# Altium schematic sheet Powering.SchDoc
size B; SheetNumber: 5; SheetTotal: 6
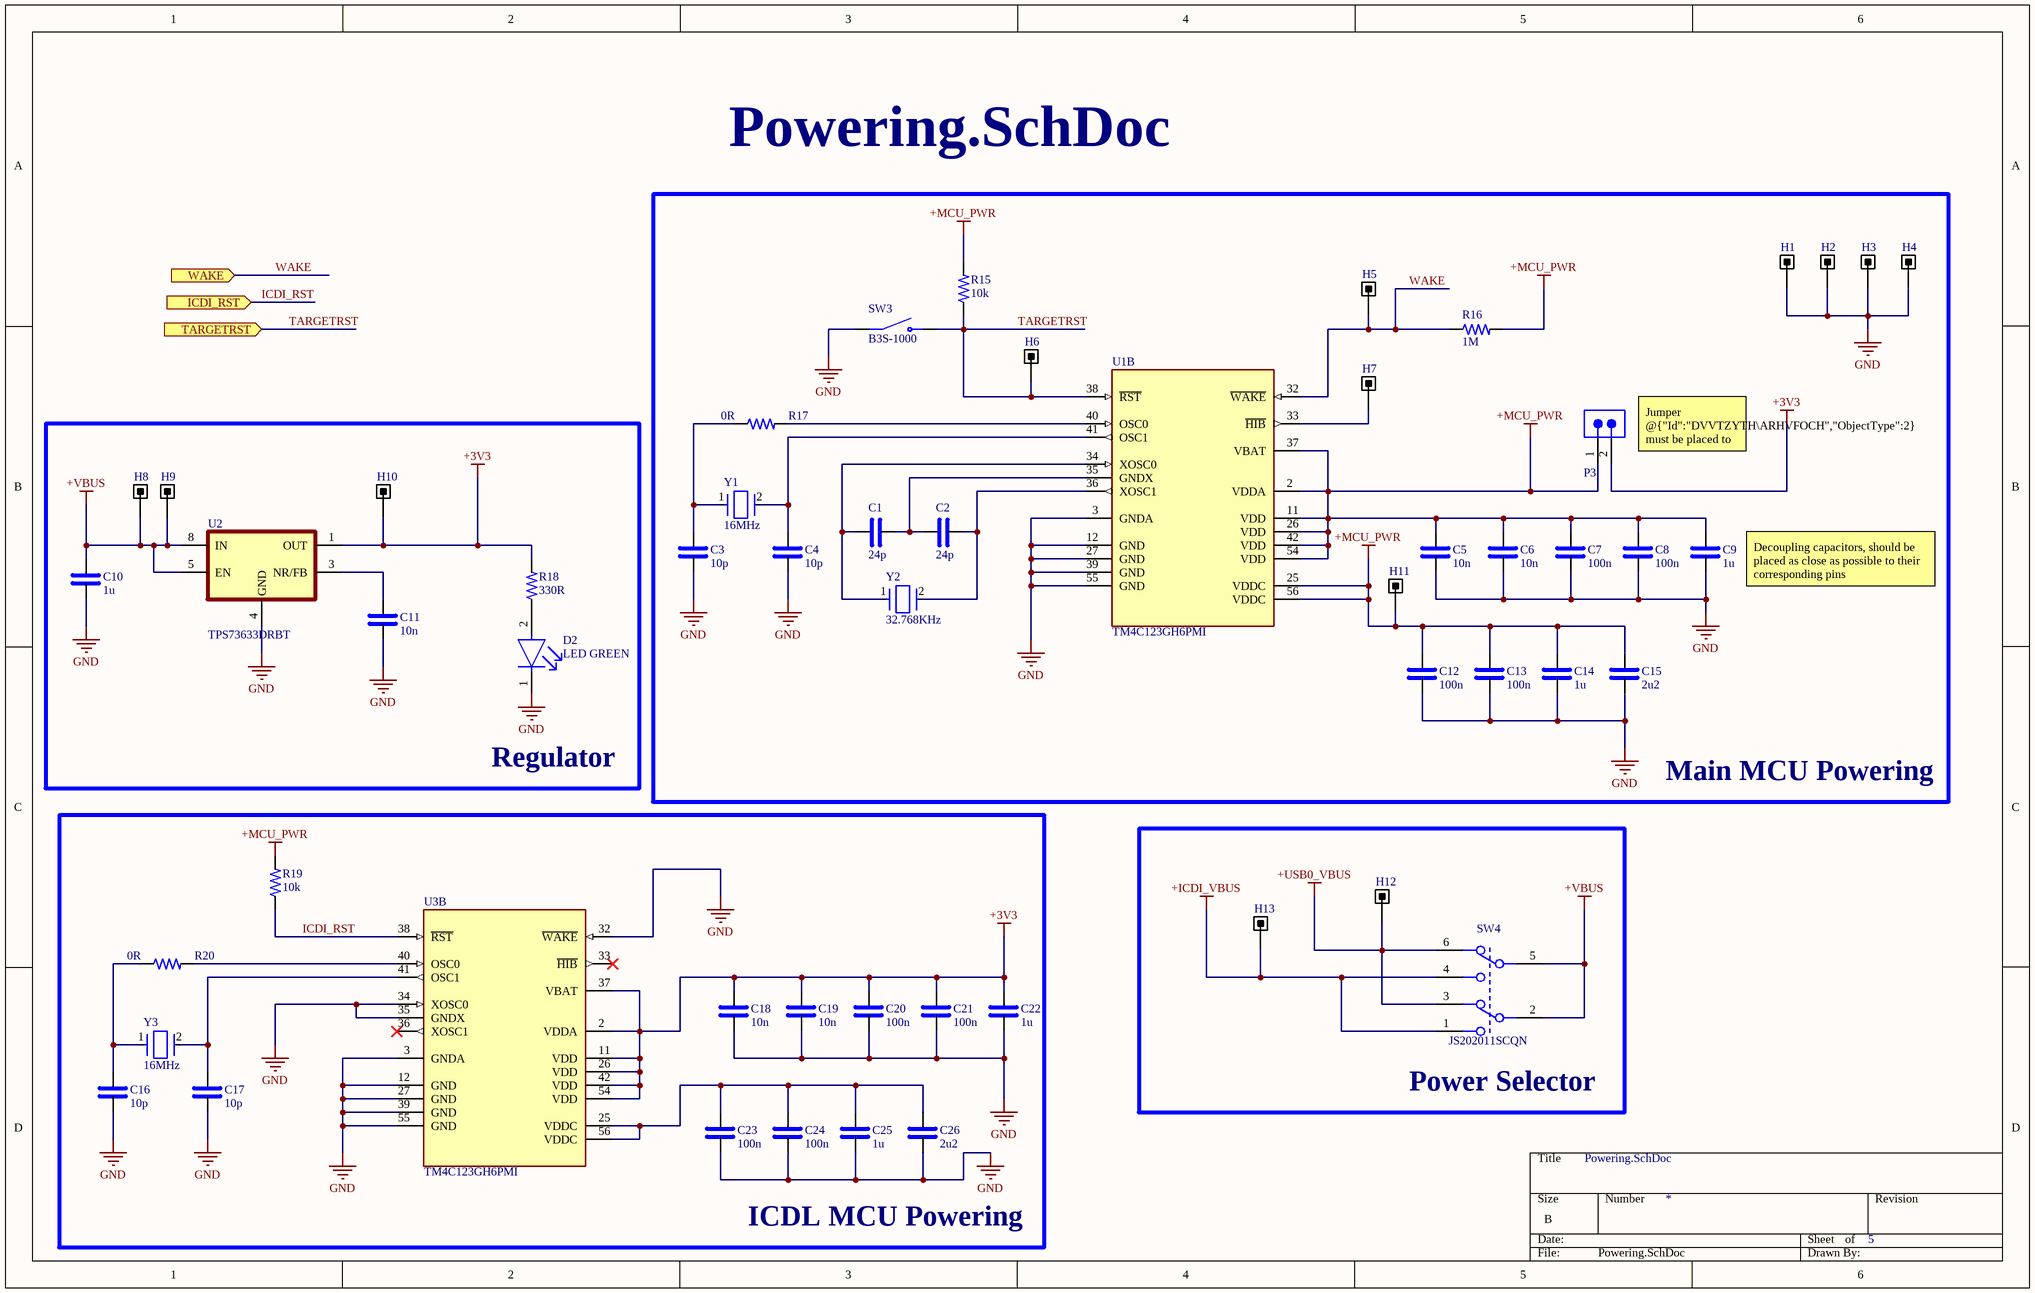
[diagram p0: Powering.SchDoc]

## Parts
C1  24p  [0402 CAP]
C2  24p  [0402 CAP]
C3  10p  [0402 CAP]
C4  10p  [0402 CAP]
C5  10n  [0402 CAP]
C6  10n  [0402 CAP]
C7  100n  [0402 CAP]
C8  100n  [0402 CAP]
C9  1u  [0402 CAP]
C10  1u  [0402 CAP]
C11  10n  [0402 CAP]
C12  100n  [0402 CAP]
C13  100n  [0402 CAP]
C14  1u  [0402 CAP]
C15  2u2  [FP-GCJ188-0_2-IPC_C]
C16  10p  [0402 CAP]
C17  10p  [0402 CAP]
C18  10n  [0402 CAP]
C19  10n  [0402 CAP]
C20  100n  [0402 CAP]
C21  100n  [0402 CAP]
C22  1u  [0402 CAP]
C23  100n  [0402 CAP]
C24  100n  [0402 CAP]
C25  1u  [0402 CAP]
C26  2u2  [FP-GCJ188-0_2-IPC_C]
D2  LED GREEN  [FP-LTST-C171GKT-MFG]
H1  Test Point  [Test Point]  (value not drawn)
H2  Test Point  [Test Point]  (value not drawn)
H3  Test Point  [Test Point]  (value not drawn)
H4  Test Point  [Test Point]  (value not drawn)
H5  Test Point  [Test Point]  (value not drawn)
H6  Test Point  [Test Point]  (value not drawn)
H7  Test Point  [Test Point]  (value not drawn)
H8  Test Point  [Test Point]  (value not drawn)
H9  Test Point  [Test Point]  (value not drawn)
H10  Test Point  [Test Point]  (value not drawn)
H11  Test Point  [Test Point]  (value not drawn)
H12  Test Point  [Test Point]  (value not drawn)
H13  Test Point  [Test Point]  (value not drawn)
P3  61300211121  [61300211121]  (value not drawn)
R15  10k  [0402 RES]
R16  1M  [0402 RES]
R17  0R  [FP-ERA3A-IPC_B]
R18  330R  [0402 RES]
R19  10k  [0402 RES]
R20  0R  [FP-ERA3A-IPC_B]
SW3  B3S-1000  [SW_B3S-1000]
SW4  JS202011SCQN  [FP-JS202011SCQN-MFG]
U1  TM4C123GH6PMI  [QFP50P1200X1200X160-64N]  (part B of 2)
U2  TPS73633DRBT  [IC_DRV8601DRBT]
U3  TM4C123GH6PMI  [QFP50P1200X1200X160-64N]  (part B of 2)
Y1  16MHz  [FP-ABM3-MFG]
Y2  32.768KHz  [FP-AB26TRB-MFG]
Y3  16MHz  [FP-ABM3-MFG]

## Blocks framed on the sheet
Main MCU Powering: C1-C9 C12-C15 H1-H7 H11 P3 R15-R17 SW3 U1 Y1 Y2
Regulator: C10 C11 D2 H8-H10 R18 U2
ICDL MCU Powering: C16-C26 R19 R20 U3 Y3
Power Selector: H12 H13 SW4

## Ports
ICDI_RST (in, see Master[4B], Connectors[6A]), TARGETRST (in, see Master[4B], Connectors[6B], In-Circuit_Debug_Interface[1A]), WAKE (in, see Master[4B], LEDS_SWITCHS[4B])

## Nets
+3V3: C18.2 C19.2 C20.2 C21.2 C22.2 H10.1 P3.2 R18.2 U2.1(OUT) U3.2(VDDA) U3.11(VDD) U3.26(VDD) U3.37(VBAT) U3.42(VDD) U3.54(VDD)
+ICDI_VBUS: H13.1 SW4.1 SW4.4
+MCU_PWR: C5.2 C6.2 C7.2 C8.2 C9.2 C12.2 C13.2 C14.2 C15.2 H11.1 P3.1 R15.2 R16.2 R19.2 U1.2(VDDA) U1.11(VDD) U1.25(VDDC) U1.26(VDD) U1.37(VBAT) U1.42(VDD) U1.54(VDD) U1.56(VDDC)
+USB0_VBUS: H12.1 SW4.3 SW4.6
+VBUS: C10.2 H8.1 H9.1 SW4.2 SW4.5 U2.5(EN) U2.8(IN)
GND: C3.1 C4.1 C5.1 C6.1 C7.1 C8.1 C9.1 C10.1 C11.1 C12.1 C13.1 C14.1 C15.1 C16.1 C17.1 C18.1 C19.1 C20.1 C21.1 C22.1 C23.1 C24.1 C25.1 C26.1 D2.1(C) H1.1 H2.1 H3.1 H4.1 SW3.2(COM) U1.3(GNDA) U1.12(GND) U1.27(GND) U1.39(GND) U1.55(GND) U2.4(GND) U3.3(GNDA) U3.12(GND) U3.27(GND) U3.32(~{WAKE}) U3.34(XOSC0) U3.35(GNDX) U3.39(GND) U3.55(GND)
ICDI_RST: R19.1 U3.38(~{RST}) ; port ICDI_RST
TARGETRST: H6.1 R15.1 SW3.4(NO) U1.38(~{RST}) ; port TARGETRST
WAKE: H5.1 R16.1 U1.32(~{WAKE}) ; port WAKE
NetC1_1: C1.1 C2.2 U1.35(GNDX)
NetC1_2: C1.2 U1.34(XOSC0) Y2.1
NetC2_1: C2.1 U1.36(XOSC1) Y2.2
NetC3_2: C3.2 R17.1 Y1.1
NetC4_2: C4.2 U1.41(OSC1) Y1.2
NetC11_2: C11.2 U2.3(NR/FB)
NetC16_2: C16.2 R20.1 Y3.1
NetC17_2: C17.2 U3.41(OSC1) Y3.2
NetC23_2: C23.2 C24.2 C25.2 C26.2 U3.25(VDDC) U3.56(VDDC)
NetD2_2: D2.2(A) R18.1
NetH7_1: H7.1 U1.33(~{HIB})
NetR17_2: R17.2 U1.40(OSC0)
NetR20_2: R20.2 U3.40(OSC0)

Not connected (* = marked no-connect by the designer): U3 33(~{HIB})* 36(XOSC1)*

## Notes on the sheet
- (near P3) Jumper @{"Id":"DVVTZYTH\ARHVFOCH","ObjectType":2} must be placed to power the MCU.
- (near C9) Decoupling capacitors, should be placed as close as possible to their corresponding pins

## Library data of the parts
C1 C2 = 0402 SMD Capacitor: 24 pF ±5% 50V Ceramic Capacitor C0G, NP0 0402 (1005 Metric); Part Number: C1005C0G1H240J; Capacitance: 10pF; Voltage: 50V; ComponentLink1Description: Link; ComponentLink1URL: *
C3 C4 C16 C17 = 0402 SMD Capacitor: 10 pF ±5% 50V Ceramic Capacitor C0G, NP0 0402 (1005 Metric); Part Number: GRM1555C1H100JZ01D; Capacitance: 10pF; Voltage: 50V; ComponentLink1Description: Link; ComponentLink1URL: *
C5 C6 C11 C18 C19 = 0402 SMD Capacitor: Ceramic Capacitor, Multilayer, Ceramic, 25V, 10% +Tol, 10% -Tol, X7R, 15% TC, 0.01uF, Surface Mount, 0402; Manufacturer: Taiyo Yuden; Manufacturer Part Number: TMK105B7103KV-F; Value: 10nF; Multilayer: Yes; ComponentLink1Description: Link; ComponentLink1URL: *; Supplier Part Number: TMK105B7103KV-F; RoHS: Yes; Category: Ceramic Capacitors; Stock: 90000; Pricing: 10000=0.00213 (USD); Mounting Technology: Surface Mount; Pins: 2; Dielectric Material: Ceramic; Package Shape: Rectangular; Case/Package: 0402; Terminal Finish: Tin; Min Operating Temperature: -55°C; Max Operating Temperature: 125°C; JESD-609 Code: e3; Capacitor Type: Ceramic; Tolerance  (fill in as +-): 10%; Package Style: SMTMeter; Packaging: Tape and Reel; Tolerance (fill in as +-): 10%; Rated DC Voltage (URdc): 25V; Temperature Characteristics Code: X7R; Termination: Wraparound; Length: 1mm; Width: 0.5mm; Height: 0.5mm; Reach SVHC Compliant: Yes; RoHS Compliant: Yes; ComponentLink2URL: https://datasheet.ciiva.com:443/pdfs/VipMasterIC/IC/TAIY/TAIY-S-A0007936089/TAIY-S-A0007936093-1.pdf?src-supplier=IHS+Markit; ComponentLink2Description: https://datasheet.ciiva.com:443/pdfs/VipMasterIC/IC/TAIY/TAIY-S-A0007936089/TAIY-S-A0007936093-1.pdf?src-supplier=IHS+Markit; ComponentLink3URL: https://datasheet.ciiva.com/129/tmk105b7103kv-f-ss-129699.pdf?src-supplier=Digikey; ComponentLink3Description: https://datasheet.ciiva.com/129/tmk105b7103kv-f-ss-129699.pdf?src-supplier=Digikey; ComponentLink4URL: https://datasheet.ciiva.com/15922/204tmk105b7103kv-f-15922348.pdf?src-supplier=Onlinecomponents.com; ComponentLink4Description: https://datasheet.ciiva.com/15922/204tmk105b7103kv-f-15922348.pdf?src-supplier=Onlinecomponents.com; ComponentLink5URL: https://datasheet.ciiva.com/30156/190tmk105b7103kv-f-30156174.pdf?src-supplier=Onlinecomponents.com; ComponentLink5Description: https://datasheet.ciiva.com/30156/190tmk105b7103kv-f-30156174.pdf?src-supplier=Onlinecomponents.com; ComponentLink6URL: https://datasheet.ciiva.com/7975/746258-7975835.pdf?src-supplier=Element14; ComponentLink6Description: https://datasheet.ciiva.com/7975/746258-7975835.pdf?src-supplier=Element14
C7 C8 C12 C13 C20 C21 C23 C24 = 0402 SMD Capacitor: Ceramic Capacitor, Multilayer, Ceramic, 16V, 10% +Tol, 10% -Tol, X7R, 15% TC, 0.1uF, Surface Mount, 0402; Manufacturer: Taiyo Yuden; Manufacturer Part Number: EMK105B7104KV-F; Value: 100nF; Multilayer: Yes; ComponentLink1Description: Link; ComponentLink1URL: *; Supplier: Avnet; Supplier Part Number: EMK105B7104KV-F; RoHS: Yes; Category: Ceramic Capacitors; Stock: 830000; Pricing: 10000=0.00238 (USD); Mounting Technology: Surface Mount; Pins: 2; Dielectric Material: Ceramic; Package Shape: Rectangular; Case/Package: 0402; Terminal Finish: Nickel; Min Operating Temperature: -55°C; Max Operating Temperature: 125°C; JESD-609 Code: e3; Capacitor Type: Ceramic; Tolerance  (fill in as +-): 10%; Package Style: SMTMeter; Packaging: Tape and Reel; Tolerance (fill in as +-): 10%; Rated DC Voltage (URdc): 16V; Temperature Characteristics Code: X7R; Termination: Wraparound; Length: 1mm; Width: 0.5mm; Height: 0.5mm; Reach SVHC Compliant: Yes; RoHS Compliant: Yes; ComponentLink2URL: https://datasheet.ciiva.com:443/pdfs/VipMasterIC/IC/TAIY/TAIY-S-A0009096450/TAIY-S-A0009096704-1.pdf?src-supplier=IHS+Markit; ComponentLink2Description: https://datasheet.ciiva.com:443/pdfs/VipMasterIC/IC/TAIY/TAIY-S-A0009096450/TAIY-S-A0009096704-1.pdf?src-supplier=IHS+Markit
C9 C10 C14 C22 C25 = 0402 SMD Capacitor: Ceramic Capacitor, Ceramic, 10V, 10% +Tol, 10% -Tol, X5R, 15% TC, 1uF, Surface Mount, 0402; Manufacturer: Johanson; Manufacturer Part Number: 100R07X105KV4T; Multilayer: Yes; ComponentLink1Description: Link; ComponentLink1URL: *; Supplier: Mouser; Supplier Part Number: 605-100R07X105KV4T; RoHS: Yes; Category: Ceramic Capacitors; Stock: 57414; Pricing: 1=0.26, 10=0.169, 50=0.169, 100=0.086, 1000=0.055, 10000=0.042 (USD); Mounting Technology: Surface Mount; Pins: 2; Dielectric Material: Ceramic; Package Shape: Rectangular; Case/Package: 0402; Terminal Finish: Nickel; Min Operating Temperature: -55°C; Max Operating Temperature: 85°C; JESD-609 Code: e3; Value: 1uF; Capacitor Type: Ceramic; Tolerance  (fill in as +-): 10%; Package Style: SMTMeter; Packaging: Tape and Reel; Tolerance (fill in as +-): 10%; Rated DC Voltage (URdc): 10V; Temperature Characteristics Code: X5R; Termination: Wraparound; Length: 1.02mm; Width: 0.51mm; Height: 0.64mm; Reach SVHC Compliant: Yes; RoHS Compliant: Yes; ComponentLink2URL: https://datasheet.ciiva.com:443/pdfs/VipMasterIC/IC/JOHA/JOHA-S-A0008489419/JOHA-S-A0008489419-1.pdf?src-supplier=IHS+Markit; ComponentLink2Description: https://datasheet.ciiva.com:443/pdfs/VipMasterIC/IC/JOHA/JOHA-S-A0008489419/JOHA-S-A0008489419-1.pdf?src-supplier=IHS+Markit; ComponentLink3URL: https://datasheet.ciiva.com/22693/jdi-full-catalog-2012-01-22693744.pdf?src-supplier=Element14; ComponentLink3Description: https://datasheet.ciiva.com/22693/jdi-full-catalog-2012-01-22693744.pdf?src-supplier=Element14; ComponentLink4URL: https://datasheet.ciiva.com/26948/getdatasheetpartid-789067-26948543.pdf?src-supplier=Verical; ComponentLink4Description: https://datasheet.ciiva.com/26948/getdatasheetpartid-789067-26948543.pdf?src-supplier=Verical
C15 C26 = 0603 SMD CAP: Ceramic Capacitor, Multilayer, Ceramic, 16V, 10% +Tol, 10% -Tol, X5R, 15% TC, 2.2uF, Surface Mount, 0603; Manufacturer: Murata; Manufacturer Part Number: GRM188R61C225KE15D; Multilayer: Yes; Supplier: Arrow Electronics; Supplier Part Number: GRM188R61C225KE15D; RoHS: Yes; Category: Ceramic Capacitors; Stock: 88000; Pricing: 8000=0.0127, 12000=0.012, 20000=0.0118, 24000=0.0111, 100000=0.0106 (USD); Mounting Technology: Surface Mount; Pins: 2; Dielectric Material: Ceramic; Package Shape: Rectangular; Case/Package: 0603; Terminal Finish: Nickel; Min Operating Temperature: -55°C; Max Operating Temperature: 85°C; JESD-609 Code: e3; Value: 2.2uF; Capacitor Type: Ceramic; Tolerance  (fill in as +-): 10%; Package Style: SMTMeter; Packaging: Tape and Reel; Tolerance (fill in as +-): 10%; Rated DC Voltage (URdc): 16V; Temperature Characteristics Code: X5R; Termination: Wraparound; Length: 1.6mm; Width: 0.8mm; Height: 0.8mm; Reach SVHC Compliant: Yes; RoHS Compliant: Yes; ComponentLink1URL: https://datasheet.ciiva.com:443/pdfs/VipMasterIC/IC/MURE/MURE-S-A0004349797/MURE-S-A0004352668-1.pdf?src-supplier=IHS+Markit; ComponentLink1Description: https://datasheet.ciiva.com:443/pdfs/VipMasterIC/IC/MURE/MURE-S-A0004349797/MURE-S-A0004352668-1.pdf?src-supplier=IHS+Markit; ComponentLink2URL: https://datasheet.ciiva.com/135/grm188r61c225ke15-01-135062.pdf?src-supplier=Digikey; ComponentLink2Description: https://datasheet.ciiva.com/135/grm188r61c225ke15-01-135062.pdf?src-supplier=Digikey; ComponentLink3URL: https://datasheet.ciiva.com/135/grm188r61c225ke15-01-135063.pdf?src-supplier=Digikey; ComponentLink3Description: https://datasheet.ciiva.com/135/grm188r61c225ke15-01-135063.pdf?src-supplier=Digikey; ComponentLink4URL: https://datasheet.ciiva.com/5417/product-5417088.pdf?src-supplier=Mouser; ComponentLink4Description: https://datasheet.ciiva.com/5417/product-5417088.pdf?src-supplier=Mouser; ComponentLink5URL: https://datasheet.ciiva.com/3777/147grm188r61c225ke1523-3777042.pdf?src-supplier=Arrow+Electronics; ComponentLink5Description: https://datasheet.ciiva.com/3777/147grm188r61c225ke1523-3777042.pdf?src-supplier=Arrow+Electronics; ComponentLink6URL: https://datasheet.ciiva.com/29199/454457-da-01-en-vs-kondensator-0603-29199689.pdf?src-supplier=Conrad; ComponentLink6Description: https://datasheet.ciiva.com/29199/454457-da-01-en-vs-kondensator-0603-29199689.pdf?src-supplier=Conrad; ComponentLink7URL: https://datasheet.ciiva.com/135/grm188r61c225ke15-01-135061.pdf?src-supplier=Digikey; ComponentLink7Description: https://datasheet.ciiva.com/135/grm188r61c225ke15-01-135061.pdf?src-supplier=Digikey; ComponentLink8URL: https://datasheet.ciiva.com/16369/product-16369274.pdf?src-supplier=Future+Electronics; ComponentLink8Description: https://datasheet.ciiva.com/16369/product-16369274.pdf?src-supplier=Future+Electronics
D2 = CMP-22017-000007-1: LED GREEN CLEAR CHIP SMD; Luminous Intensity: 12mcd; Lens Color: Colorless; Dominant Wavelength: 569nm; Number of LEDs: 1; Power Dissipation: 100mW; Viewing Angle: 130°; Reverse Voltage: 5V; Test Current: 10mA; Forward Voltage: 2.1V; Wavelength: 585nm; Lens Style: Diffused; Forward Current: 30mA; Height: 0.8mm; Mount: Surface Mount; Package Quantity: 1; Length: 2mm; Case Code (Metric): 2012; Number of Pins: 2; Number of Elements: 1; Packaging: Tape and Reel; Color: Green; Min Operating Temperature: -55°C; Case/Package: 0805; Power Rating: 100mW; Max Operating Temperature: 85°C; Radiation Hardening: No; Depth: 1.25mm; Lens Transparency: Clear; Width: 1.25mm; Lead Free: Lead Free; Case Code (Imperial): 0805; Illumination Color: Green
P3 = 61300211121: WR-PHD Pin Header, THT, Vertical, pitch 2.54mm, 1 Row, 2P; Manufacturer: Wurth Elektronik; Contact Resistance: 20mOhm; Rated Current: 3A; Working Voltage: 250V; Withstanding Voltage: 500V; Manufacturer Part Number: 61300211121; Category: Board-to-Board Connectors; Match Code: WR-PHD; ComponentLink1Description: Website Link; ComponentLink1URL: https://www.we-online.com/redexpert/article/61300211121?ad; ComponentLink2Description: Datasheet Link; ComponentLink2URL: https://www.we-online.com/redexpert/spec/61300211121?ad; Mount: Through Hole; Operating Temperature Max: 105°C; Operating Temperature Min: -40°C; Packaging: Bag; Gender: Pin Header; Number of Pins: 2; Number of Rows: 1; Orientation: Vertical; Pitch: 2.54mm
R15 R19 = 0402 SMD Resistor: Fixed Resistor, Metal Glaze/thick Film, 0.0625W, 10000ohm, 50V, 1% +/-Tol, 100ppm/Cel, Surface Mount, 0402; Manufacturer: Yageo; Manufacturer Part Number: RC0402FR-0710KL; Additional Feature: LASER TRIMMABLE; Power: 62.5mW; Rated Temperature: 70°C; Value: 10kR; Temperature Coefficient: 100ppm/°C; Package Height: 0.35mm; Package Length: 1mm; Package Width: 0.5mm; ComponentLink1Description: Link; ComponentLink1URL: *; Supplier: Future Electronics; Supplier Part Number: 3388022; RoHS: Yes; Category: Chip SMD Resistors; Stock: 31210000; Pricing: 10000=0.0016, 100000=0.0015, 300000=0.0015, 1250000=0.0014, 3000000=0.0013 (USD); Mounting Technology: Surface Mount; Pins: 2; Package Shape: Rectangular; Case/Package: 0402; Terminal Finish: Nickel; Min Operating Temperature: -55°C; Max Operating Temperature: 155°C; JESD-609 Code: e3; Termination: Wraparound; Resistor Type: FIXED RESISTOR; Construction: Chip; Packaging: Tape and Reel; Technology: METAL GLAZE/THICK FILM; Working Voltage: 50V; Reach SVHC Compliant: Yes; RoHS Compliant: Yes; ComponentLink2URL: https://datasheet.ciiva.com:443/pdfs/VipMasterIC/IC/YAGO/YAGO-S-A0008145938/YAGO-S-A0008145938-1.pdf?src-supplier=IHS+Markit; ComponentLink2Description: https://datasheet.ciiva.com:443/pdfs/VipMasterIC/IC/YAGO/YAGO-S-A0008145938/YAGO-S-A0008145938-1.pdf?src-supplier=IHS+Markit
R16 = 0402 SMD Resistor: 1 MOhms ±1% 0.063W, 1/16W Chip Resistor 0402 (1005 Metric) Thick Film; Part Number: MCR01MRTF1004; Resistance: 1M; ComponentLink1Description: Link; ComponentLink1URL: *; Tolerance: ±1%; Wattage: 1/16W
R17 R20 = 0603 SMD RES: Fixed Resistor, Metal Glaze/thick Film, 0.1W, 0ohm, Surface Mount, 0603; Manufacturer: Panasonic; Manufacturer Part Number: ERJ-3GEY0R00V; Power: 100mW; Rated Temperature: 70°C; Package Height: 0.45mm; Package Length: 1.6mm; Package Width: 0.8mm; Reference Standard: AEC-Q200; Supplier: Mouser; Supplier Part Number: 667-ERJ-3GEY0R00V; RoHS: Yes; Category: Chip SMD Resistors; Stock: 3258844; Pricing: 1=0.1, 10=0.022, 50=0.022, 100=0.01, 1000=0.008, 10000=0.004 (USD); Mounting Technology: Surface Mount; Pins: 2; Package Shape: Rectangular; Case/Package: 0603; Terminal Finish: Nickel; Min Operating Temperature: -55°C; Max Operating Temperature: 155°C; JESD-609 Code: e3; Resistor Type: FIXED RESISTOR; Construction: Rectangular; Packaging: Tape and Reel; Value: 0R; Technology: METAL GLAZE/THICK FILM; Termination: Wraparound; Reach SVHC Compliant: Yes; RoHS Compliant: Yes; ComponentLink1URL: https://datasheet.ciiva.com:443/pdfs/VipMasterIC/IC/PANA/PANA-S-A0009459603/PANA-S-A0009459603-1.pdf?src-supplier=IHS+Markit; ComponentLink1Description: https://datasheet.ciiva.com:443/pdfs/VipMasterIC/IC/PANA/PANA-S-A0009459603/PANA-S-A0009459603-1.pdf?src-supplier=IHS+Markit; ComponentLink2URL: https://datasheet.ciiva.com/27055/1935748-27055113.pdf?src-supplier=Jameco; ComponentLink2Description: https://datasheet.ciiva.com/27055/1935748-27055113.pdf?src-supplier=Jameco; ComponentLink3URL: https://datasheet.ciiva.com/11808/0900766b80f806dd-11808207.pdf?src-supplier=Rs; ComponentLink3Description: https://datasheet.ciiva.com/11808/0900766b80f806dd-11808207.pdf?src-supplier=Rs; ComponentLink4URL: https://datasheet.ciiva.com/46377/1678796-46377868.pdf?src-supplier=Element14; ComponentLink4Description: https://datasheet.ciiva.com/46377/1678796-46377868.pdf?src-supplier=Element14; ComponentLink5URL: https://datasheet.ciiva.com/9198/aoa0000ce1-9198975.pdf?src-supplier=Avnet; ComponentLink5Description: https://datasheet.ciiva.com/9198/aoa0000ce1-9198975.pdf?src-supplier=Avnet; ComponentLink6URL: https://datasheet.ciiva.com/16834/aoa0000ce1-16834828.pdf?src-supplier=Future+Electronics; ComponentLink6Description: https://datasheet.ciiva.com/16834/aoa0000ce1-16834828.pdf?src-supplier=Future+Electronics; ComponentLink7URL: https://datasheet.ciiva.com/30199/4aoa0000ce1-30199822.pdf?src-supplier=Onlinecomponents.com; ComponentLink7Description: https://datasheet.ciiva.com/30199/4aoa0000ce1-30199822.pdf?src-supplier=Onlinecomponents.com; ComponentLink8URL: https://datasheet.ciiva.com/43460/1678796-43460647.pdf?src-supplier=Farnell; ComponentLink8Description: https://datasheet.ciiva.com/43460/1678796-43460647.pdf?src-supplier=Farnell; ComponentLink9URL: https://datasheet.ciiva.com/5959/1678796-5959707.pdf?src-supplier=Farnell; ComponentLink9Description: https://datasheet.ciiva.com/5959/1678796-5959707.pdf?src-supplier=Farnell; ComponentLink10URL: https://datasheet.ciiva.com/28695/1678796-28695833.pdf?src-supplier=Element14; ComponentLink10Description: https://datasheet.ciiva.com/28695/1678796-28695833.pdf?src-supplier=Element14; ComponentLink11URL: https://datasheet.ciiva.com/16758/70255313-16758527.pdf?src-supplier=Allied+Electronics; ComponentLink11Description: https://datasheet.ciiva.com/16758/70255313-16758527.pdf?src-supplier=Allied+Electronics; ComponentLink12URL: https://datasheet.ciiva.com/48532/aoa0000ce1-48532165.pdf?src-supplier=Avnet; ComponentLink12Description: https://datasheet.ciiva.com/48532/aoa0000ce1-48532165.pdf?src-supplier=Avnet
R18 = 0402 SMD Resistor: Fixed Resistor, Metal Glaze/thick Film, 0.125W, 330ohm, 75V, 1% +/-Tol, 100ppm/Cel, Surface Mount, 0402; Manufacturer: Vishay Dale; Manufacturer Part Number: RCC0402330RFKED; ComponentLink1Description: Link; ComponentLink1URL: *; Supplier: Digikey; Supplier Part Number: 541-RCC0402330RFKEDCT-ND; RoHS: Yes; Category: Chip SMD Resistors; Stock: 92625; Pricing: 1=0.1, 10=0.046, 50=0.0296, 100=0.0248, 500=0.01724, 1000=0.01499, 5000=0.0113 (USD)
SW3 = B3S-1000: Tactile Switch SPST-NO Top Actuated Surface Mount; pin to pad: 2>1+2 4>3+4; MF: Omron; Availability: Unavailable; Value: *; Package: None; Price: None; MP: B3S-1000; SnapEDA_Link: https://www.snapeda.com/parts/B3S-1000/Omron%20Electronics%20Inc-EMC%20Div/view-part/47351/?ref=snap
SW4 = CMP-2000-05087-3: SWITCH SLIDE DPDT 300MA 6V; Switch Function: On-On; Actuator Type: Standard; Switch Travel: 2mm; Actuator Color: Black; Contact Resistance: 70mR; Electrical Life: 5000Cycles; Actuator Material: Nylon; REACH SVHC: No SVHC; Series: JS; Min Operating Temperature: -20°C; Depth: 7.5mm; Housing Material: Nylon; Voltage Rating (DC): 6V; Max Operating Temperature: 85°C; Contact Current Rating: 300mA; Package Quantity: 1; Contact Plating: Silver; Contact Material: Copper Alloy; Throw Configuration: DPDT; Current Rating: 300mA; Orientation: Vertical; Max Current Rating: 300mA; Max Voltage Rating (DC): 6V; Flammability Rating: UL94 V-2; Length: 9mm; Packaging: Tape and Reel; Mount: Surface Mount; Actuator Length: 2mm; Lead Free: Lead Free; Termination: Gull Wing; Radiation Hardening: No
U1 U3 = TM4C123GH6PMI: ARMÂ® CortexÂ®-M4F Tivaâ„¢ C Microcontroller IC 32-Bit 80MHz 256KB _256K x 8_ FLASH 64-LQFP _10x10_; MF: Texas Instruments; Price: None; Availability: Unavailable; SnapEDA_Link: https://www.snapeda.com/parts/TM4C123GH6PMI/Texas%20Instruments/view-part/557012/?ref=snap; Value: *; Package: LQFP-64 Texas Instruments; MP: TM4C123GH6PMI
Y1 Y3 = CMP-27762-013555-1: Crystal 16MHz ±20ppm 18pF SMD-2 5mm x 3.2mm; ESR (Equivalent Series Resistance): 40R; Frequency Stability: 50ppm; Series Resistance: 60R; Frequency Tolerance: 20ppm; Min Operating Temperature: -20°C; Frequency: 16MHz; Max Operating Temperature: 70°C; Depth: 3.2mm; Length: 5mm; Height: 0.051inch; Mount: Surface Mount; Resistor Type: Ceramic; Package Quantity: 1000; Number of Pins: 2; Width: 3.2mm; Case/Package: CSMD; Tolerance: 20ppm; Series: ABM3; Termination: SMD/SMT; Accuracy: 20ppm; REACH SVHC: Yes; Load Capacitance: 18pF; Operating Frequency: 16 MHz; Lead Free: Lead Free; Packaging: Tape and Reel
Y2 = CMP-27762-006068-1: CRYSTAL 32.7680KHZ 12.5PF TH; Frequency Stability: -0.034ppm; Frequency Tolerance: 20ppm; Series Resistance: 50kR; Case/Package: Radial; Package Quantity: 500; Packaging: Tape and Reel; Lead Pitch: 2.54mm; Termination: Radial; Mount: Surface Mount; Frequency: 32.768kHz; Min Operating Temperature: -40°C; REACH SVHC: No SVHC; Load Capacitance: 12.5pF; Lead Free: Lead Free; Operating Frequency: 32.768 kHz; Max Operating Temperature: 85°C; Length: 6mm; Height: 0.075inch; Depth: 1.9mm; Tolerance: 20ppm; ESR (Equivalent Series Resistance): 50kR; Number of Pins: 2; Series: AB26TRB
U2 = TPS73633DRBT: Package: None; Price: None; Value: *; MP: TPS73633DRBT; Availability: Unavailable